# EAGLE schematic rgbsh (EAGLE 9.3.0)
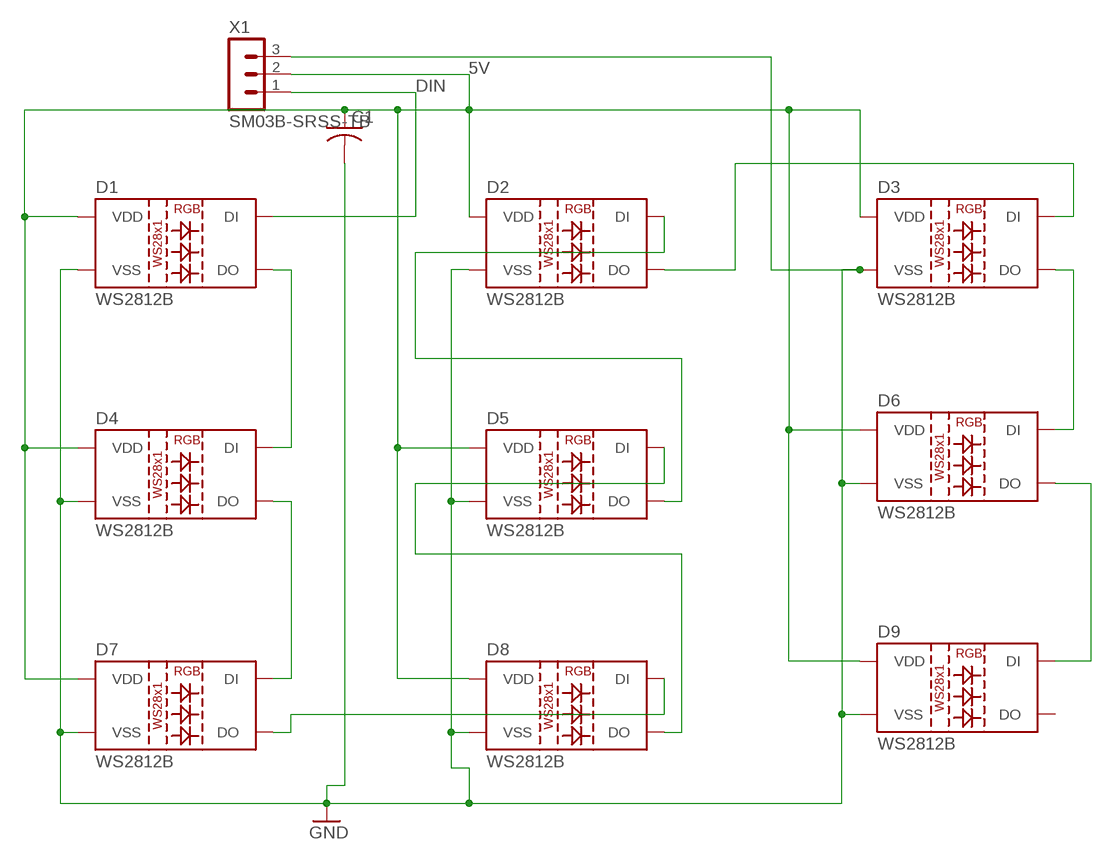
[diagram p0: schematic, sheet 1]

## Parts
C1  C-USC0805K  [C0805K]
D1  WS2812B  [WS2812B]
D2  WS2812B  [WS2812B]
D3  WS2812B  [WS2812B]
D4  WS2812B  [WS2812B]
D5  WS2812B  [WS2812B]
D6  WS2812B  [WS2812B]
D7  WS2812B  [WS2812B]
D8  WS2812B  [WS2812B]
D9  WS2812B  [WS2812B]
X1  SM03B-SRSS-TB  [SM03B-SRSS-TB]

## Nets
5V: C1.1 D1.1(VDD) D2.1(VDD) D3.1(VDD) D4.1(VDD) D5.1(VDD) D6.1(VDD) D7.1(VDD) D8.1(VDD) D9.1(VDD) X1.2
DIN: D1.4(DI) X1.1
GND: C1.2 D1.3(VSS) D2.3(VSS) D3.3(VSS) D4.3(VSS) D5.3(VSS) D6.3(VSS) D7.3(VSS) D8.3(VSS) D9.3(VSS) X1.3
N$5: D1.2(DO) D4.4(DI)
N$6: D4.2(DO) D7.4(DI)
N$7: D7.2(DO) D8.4(DI)
N$8: D5.4(DI) D8.2(DO)
N$9: D2.4(DI) D5.2(DO)
N$10: D2.2(DO) D3.4(DI)
N$11: D3.2(DO) D6.4(DI)
N$12: D6.2(DO) D9.4(DI)
Unconnected: D9.2(DO)

## Library data of the parts
C1 = adafruit:C-US: CAPACITOR, American symbol
D1-D9 = SparkFun-LED:WS2812B: WS2812B SMD addressable RGB LED 5x5mm SMD LED with built-in controller IC. Color: Red/Green/Blue mC Rating: RGB: 390, 660, 180 mcd Forward Voltage: RGB: 2.0, 3.0, 3.0 V Packages:WS2812B SparkFun Products: Blynk Board - ESP8266 <https://www.sparkfun.com/products/13794>; PROD_ID: DIO-12503
X1 = con-JST SH:SM03B-SRSS: JST SH series header 1.00mm pitch disconnectable crimp style connectors, horizontal (side entry type), 3 pins

## Net classes
0 default: clearance 0.381 mm